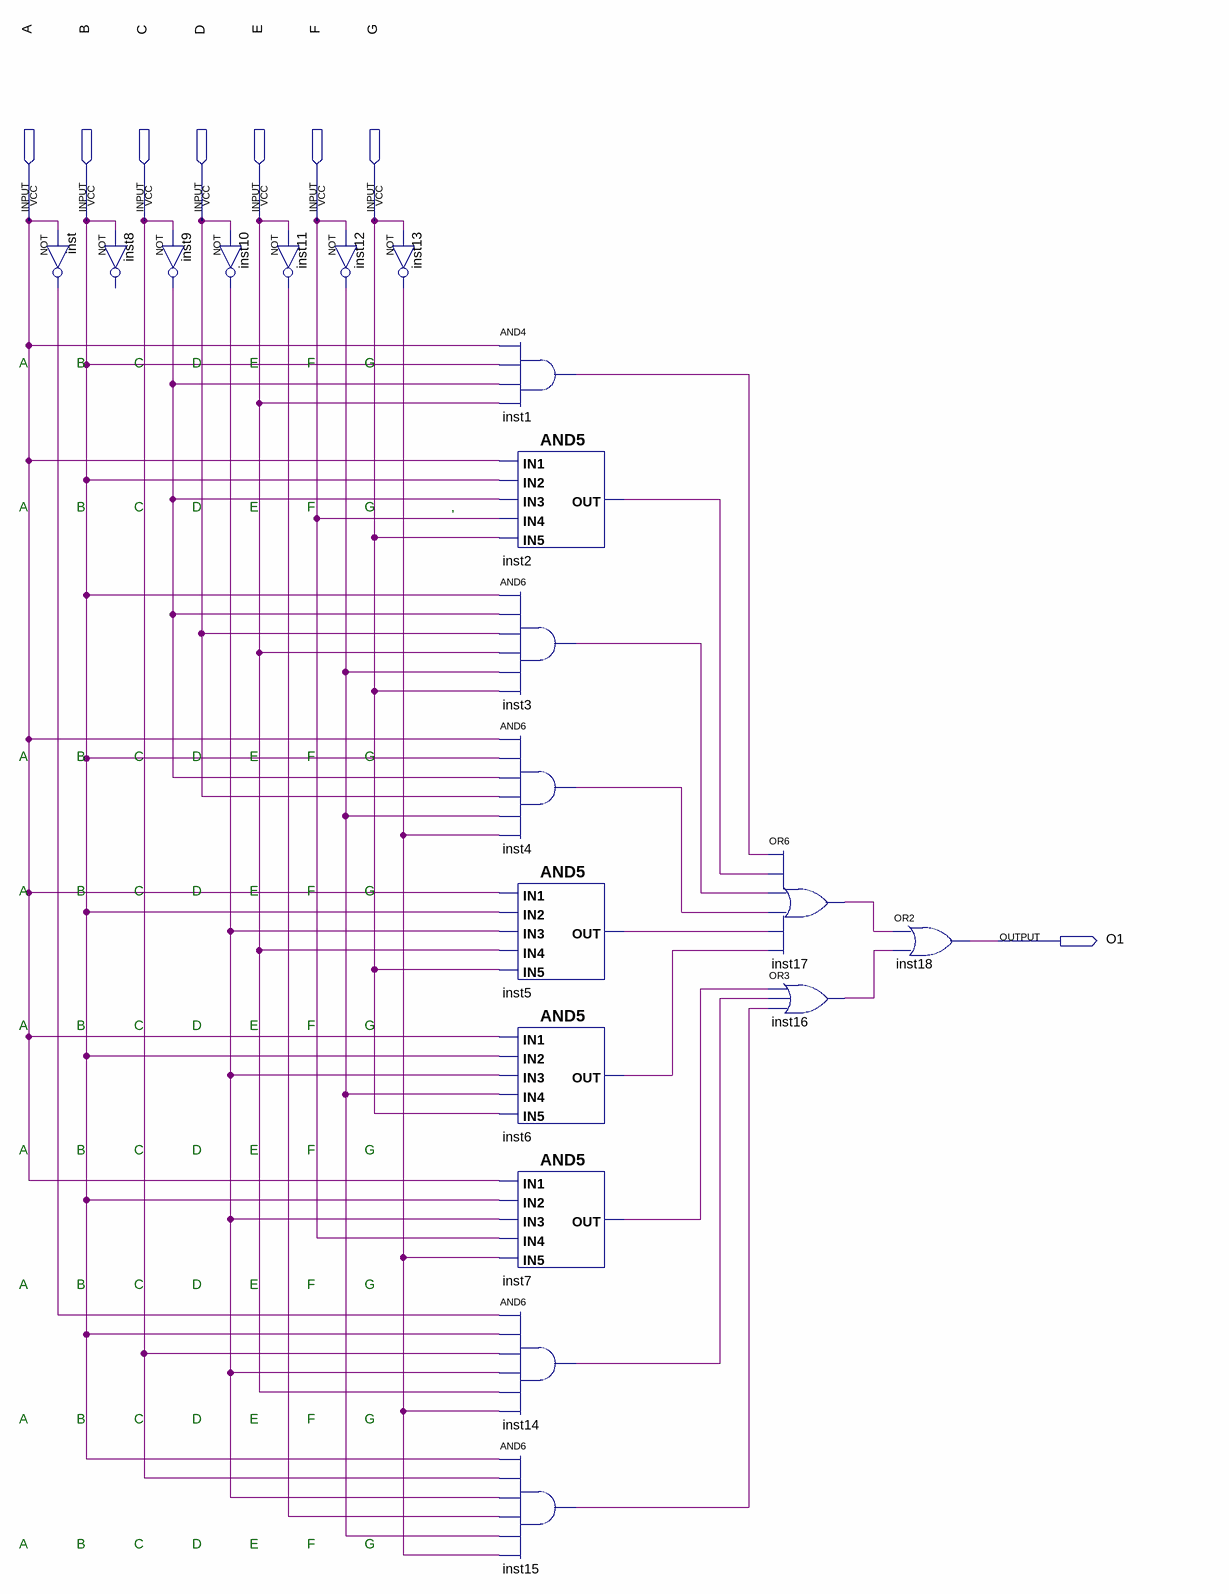
[diagram p0: schematic sheet]
// Quartus schematic linha4led1.bdf as structural Verilog: 19 symbols, 8 pins
module linha4led1 (
  input  A,
  input  B,
  input  C,
  input  D,
  input  E,
  input  F,
  input  G,
  output O1
);

  wire inst1_out, inst2_out, inst3_out, inst4_out, inst5_out, inst6_out, inst7_out, inst9_out, inst10_out,
       inst11_out, inst12_out, inst13_out, inst14_out, inst15_out, inst16_out, inst17_out, inst_out;

  not inst (inst_out, A);
  // NOT inst8 has open pins: IN=B, OUT=open
  not inst9 (inst9_out, C);
  not inst10 (inst10_out, D);
  not inst11 (inst11_out, E);
  not inst12 (inst12_out, F);
  not inst13 (inst13_out, G);
  and inst1 (inst1_out, A, B, inst9_out, E);
  and inst2 (inst2_out, A, B, inst9_out, F, G);
  and inst3 (inst3_out, B, inst9_out, D, E, inst12_out, G);
  and inst4 (inst4_out, A, B, inst9_out, D, inst12_out, inst13_out);
  and inst5 (inst5_out, A, B, inst10_out, E, G);
  and inst6 (inst6_out, A, B, inst10_out, inst12_out, G);
  and inst7 (inst7_out, A, B, inst10_out, F, inst13_out);
  and inst14 (inst14_out, inst_out, B, C, inst10_out, E, inst13_out);
  and inst15 (inst15_out, B, C, inst10_out, inst11_out, inst12_out, inst13_out);
  or inst17 (inst17_out, inst1_out, inst2_out, inst3_out, inst4_out, inst5_out, inst6_out);
  or inst16 (inst16_out, inst7_out, inst14_out, inst15_out);
  or inst18 (O1, inst17_out, inst16_out);

  // Notes on the sheet:
  //   A
  //   B
  //   C
  //   D
  //   E
  //   F
  //   G
  //   A
  //   B
  //   C
  //   D
  //   E
  //   F
  //   G
  //   ,
  //   A
  //   B
  //   C
  //   D
  //   E
  //   F
  //   G
  //   A
  //   B
  //   C
  //   D
  //   E
  //   F
  //   G
  //   A
  //   B
  //   C
  //   D
  //   E
  //   F
  //   G
  //   A
  //   B
  //   C
  //   D
  //   E
  //   F
  //   G
  //   A
  //   B
  //   C
  //   D
  //   E
  //   F
  //   G
  //   A
  //   B
  //   C
  //   D
  //   E
  //   F
  //   G
  //   A
  //   B
  //   C
  //   D
  //   E
  //   F
  //   G
endmodule
